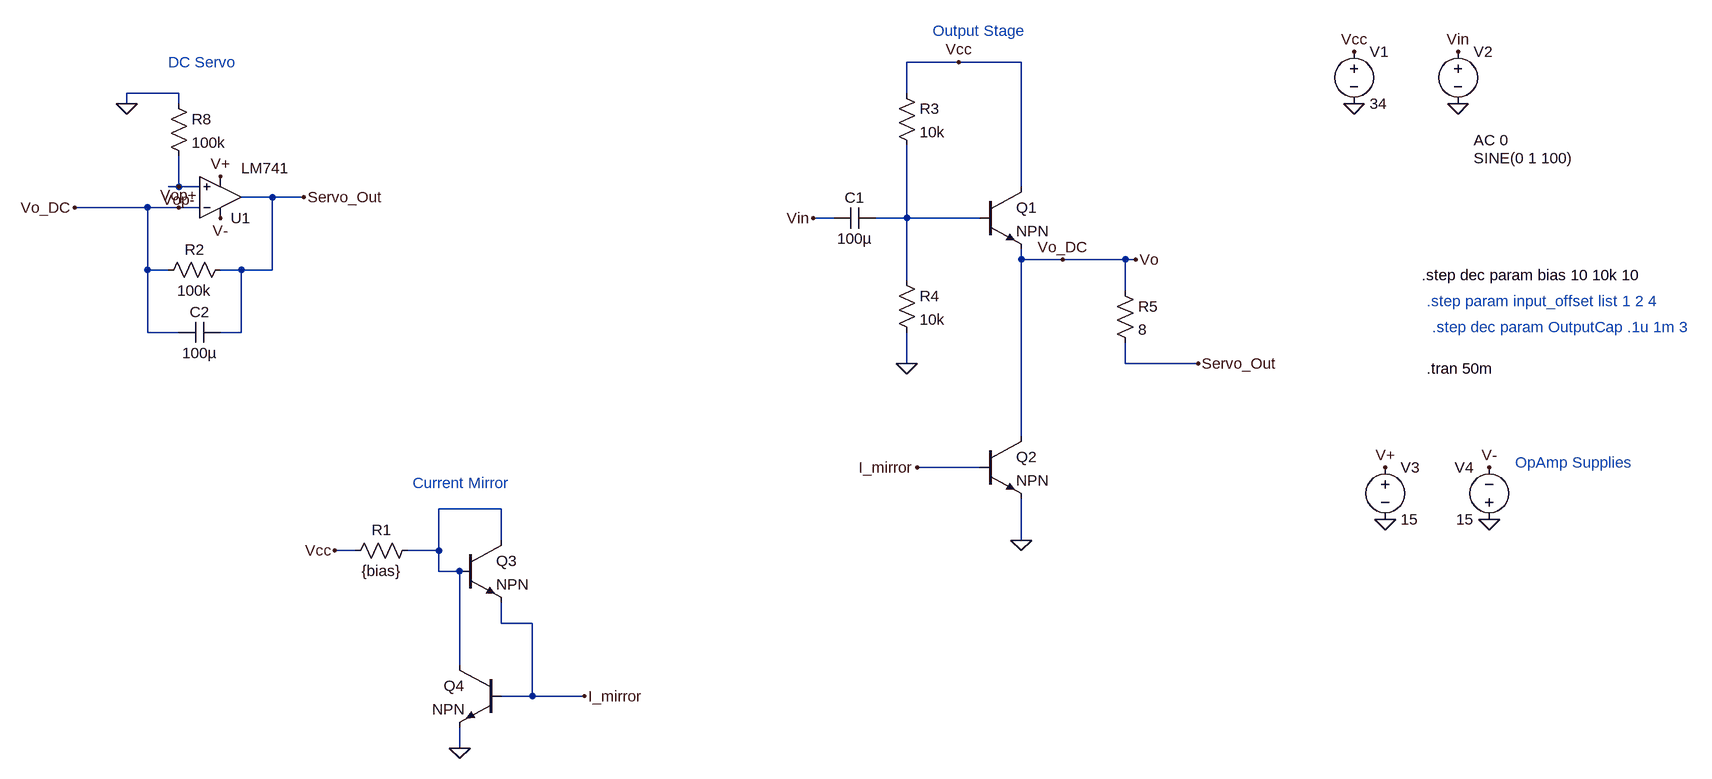
[diagram p0: schematic ClassA_withServo.asc]
ClassA_withServo.asc, the LTspice schematic file:
Version 4
SHEET 1 880 680
WIRE -1248 -432 -1328 -432
WIRE -1152 -432 -1248 -432
WIRE -2448 -384 -2528 -384
WIRE -1328 -384 -1328 -432
WIRE -2528 -368 -2528 -384
WIRE -2448 -368 -2448 -384
WIRE -2448 -240 -2448 -288
WIRE -2448 -240 -2464 -240
WIRE -2416 -240 -2448 -240
WIRE -1152 -240 -1152 -432
WIRE -2304 -224 -2352 -224
WIRE -2256 -224 -2304 -224
WIRE -2496 -208 -2608 -208
WIRE -2448 -208 -2496 -208
WIRE -2416 -208 -2448 -208
WIRE -1440 -192 -1472 -192
WIRE -1328 -192 -1328 -304
WIRE -1328 -192 -1376 -192
WIRE -1216 -192 -1328 -192
WIRE -1152 -128 -1152 -144
WIRE -1088 -128 -1152 -128
WIRE -992 -128 -1088 -128
WIRE -976 -128 -992 -128
WIRE -2496 -112 -2496 -208
WIRE -2464 -112 -2496 -112
WIRE -2352 -112 -2384 -112
WIRE -2304 -112 -2304 -224
WIRE -2304 -112 -2352 -112
WIRE -1328 -96 -1328 -192
WIRE -992 -80 -992 -128
WIRE -2496 -16 -2496 -112
WIRE -2448 -16 -2496 -16
WIRE -2352 -16 -2352 -112
WIRE -2352 -16 -2384 -16
WIRE -1328 32 -1328 -16
WIRE -992 32 -992 0
WIRE -880 32 -992 32
WIRE -1152 144 -1152 -128
WIRE -1216 192 -1312 192
WIRE -1952 256 -2048 256
WIRE -1952 304 -1952 256
WIRE -1152 304 -1152 240
WIRE -2176 320 -2208 320
WIRE -2048 320 -2048 256
WIRE -2048 320 -2096 320
WIRE -2048 352 -2048 320
WIRE -2016 352 -2048 352
WIRE -1952 432 -1952 400
WIRE -1904 432 -1952 432
WIRE -2016 496 -2016 352
WIRE -1904 544 -1904 432
WIRE -1904 544 -1952 544
WIRE -1824 544 -1904 544
WIRE -2016 624 -2016 592
FLAG -640 -448 Vcc
FLAG -640 -368 0
FLAG -480 -368 0
FLAG -480 -448 Vin
FLAG -432 272 0
FLAG -592 272 0
FLAG -592 192 V+
FLAG -432 192 V-
FLAG -1328 32 0
FLAG -1248 -432 Vcc
FLAG -976 -128 Vo
FLAG -1088 -128 Vo_DC
FLAG -1472 -192 Vin
FLAG -2384 -256 V+
FLAG -2384 -192 V-
FLAG -2256 -224 Servo_Out
FLAG -2448 -208 Vop+
FLAG -2448 -240 Vop-
FLAG -2608 -208 Vo_DC
FLAG -2528 -368 0
FLAG -880 32 Servo_Out
FLAG -1152 304 0
FLAG -2016 624 0
FLAG -2208 320 Vcc
FLAG -1824 544 I_mirror
FLAG -1312 192 I_mirror
SYMBOL voltage -640 -464 R0
WINDOW 123 0 0 Left 2
WINDOW 39 0 0 Left 2
SYMATTR InstName V1
SYMATTR Value 34
SYMBOL voltage -480 -464 R0
WINDOW 3 24 180 Left 2
WINDOW 123 24 152 Left 2
WINDOW 39 24 124 Left 2
SYMATTR Value SINE(0 1 100)
SYMATTR Value2 AC 0
SYMATTR InstName V2
SYMBOL voltage -592 176 R0
WINDOW 123 0 0 Left 2
WINDOW 39 0 0 Left 2
SYMATTR InstName V3
SYMATTR Value 15
SYMBOL voltage -432 288 R180
WINDOW 0 24 96 Left 2
WINDOW 3 24 16 Left 2
WINDOW 123 0 0 Left 2
WINDOW 39 0 0 Left 2
SYMATTR InstName V4
SYMATTR Value 15
SYMBOL npn -1216 -240 R0
SYMATTR InstName Q1
SYMBOL res -1344 -400 R0
SYMATTR InstName R3
SYMATTR Value 10k
SYMBOL res -1344 -112 R0
SYMATTR InstName R4
SYMATTR Value 10k
SYMBOL cap -1440 -176 R270
WINDOW 0 32 32 VTop 2
WINDOW 3 0 32 VBottom 2
SYMATTR InstName C1
SYMATTR Value 100µ
SYMBOL res -1008 -96 R0
SYMATTR InstName R5
SYMATTR Value 8
SYMBOL Opamps\\LM741 -2384 -160 M180
WINDOW 3 32 109 Left 2
SYMATTR InstName U1
SYMBOL res -2480 -96 R270
WINDOW 0 32 56 VTop 2
WINDOW 3 0 56 VBottom 2
SYMATTR InstName R2
SYMATTR Value 100k
SYMBOL cap -2448 0 R270
WINDOW 0 32 32 VTop 2
WINDOW 3 0 32 VBottom 2
SYMATTR InstName C2
SYMATTR Value 100µ
SYMBOL res -2464 -384 R0
SYMATTR InstName R8
SYMATTR Value 100k
SYMBOL npn -1216 144 R0
SYMATTR InstName Q2
SYMBOL npn -2016 304 R0
SYMATTR InstName Q3
SYMBOL npn -1952 496 M0
SYMATTR InstName Q4
SYMBOL res -2192 336 R270
WINDOW 0 32 56 VTop 2
WINDOW 3 0 56 VBottom 2
SYMATTR InstName R1
SYMATTR Value {bias}
TEXT -528 40 Left 2 !.tran 50m
TEXT -536 -104 Left 2 !.step dec param bias 10 10k 10
TEXT -528 -64 Left 2 ;.step param input_offset list 1 2 4
TEXT -520 -24 Left 2 ;.step dec param OutputCap .1u 1m 3
TEXT -392 184 Left 2 ;OpAmp Supplies
TEXT -2464 -432 Left 2 ;DC Servo
TEXT -1288 -480 Left 2 ;Output Stage
TEXT -2088 216 Left 2 ;Current Mirror

The netlist it stands for:
* ClassA_withServo.asc
V1 Vcc 0 34
V2 Vin 0 SINE(0 1 100) AC 0
V3 V+ 0 15
V4 0 V- 15
Q1 Vcc N001 Vop+ 0 NPN
R3 Vcc N001 10k
R4 N001 0 10k
C1 Vin N001 100µ
R5 Vop+ Servo_Out 8
XU1 Vop- Vop+ V- V+ Servo_Out LM741  ; pins In+ In- V+ V- OUT
R2 Vop+ Servo_Out 100k
C2 Vop+ Servo_Out 100µ
R8 0 Vop- 100k
Q2 Vop+ I_mirror 0 0 NPN
Q3 N002 N002 I_mirror 0 NPN
Q4 N002 I_mirror 0 0 NPN
R1 Vcc N002 {bias}
.model NPN NPN
.model PNP PNP
.lib standard.bjt
.tran 50m
.step dec param bias 10 10k 10
* .step param input_offset list 1 2 4
* .step dec param OutputCap .1u 1m 3
* OpAmp Supplies
* DC Servo
* Output Stage
* Current Mirror
.lib LM741.lib
.backanno
.end